# EAGLE design rca_studio_II_mutli_v5 (EAGLE 8.3.2)
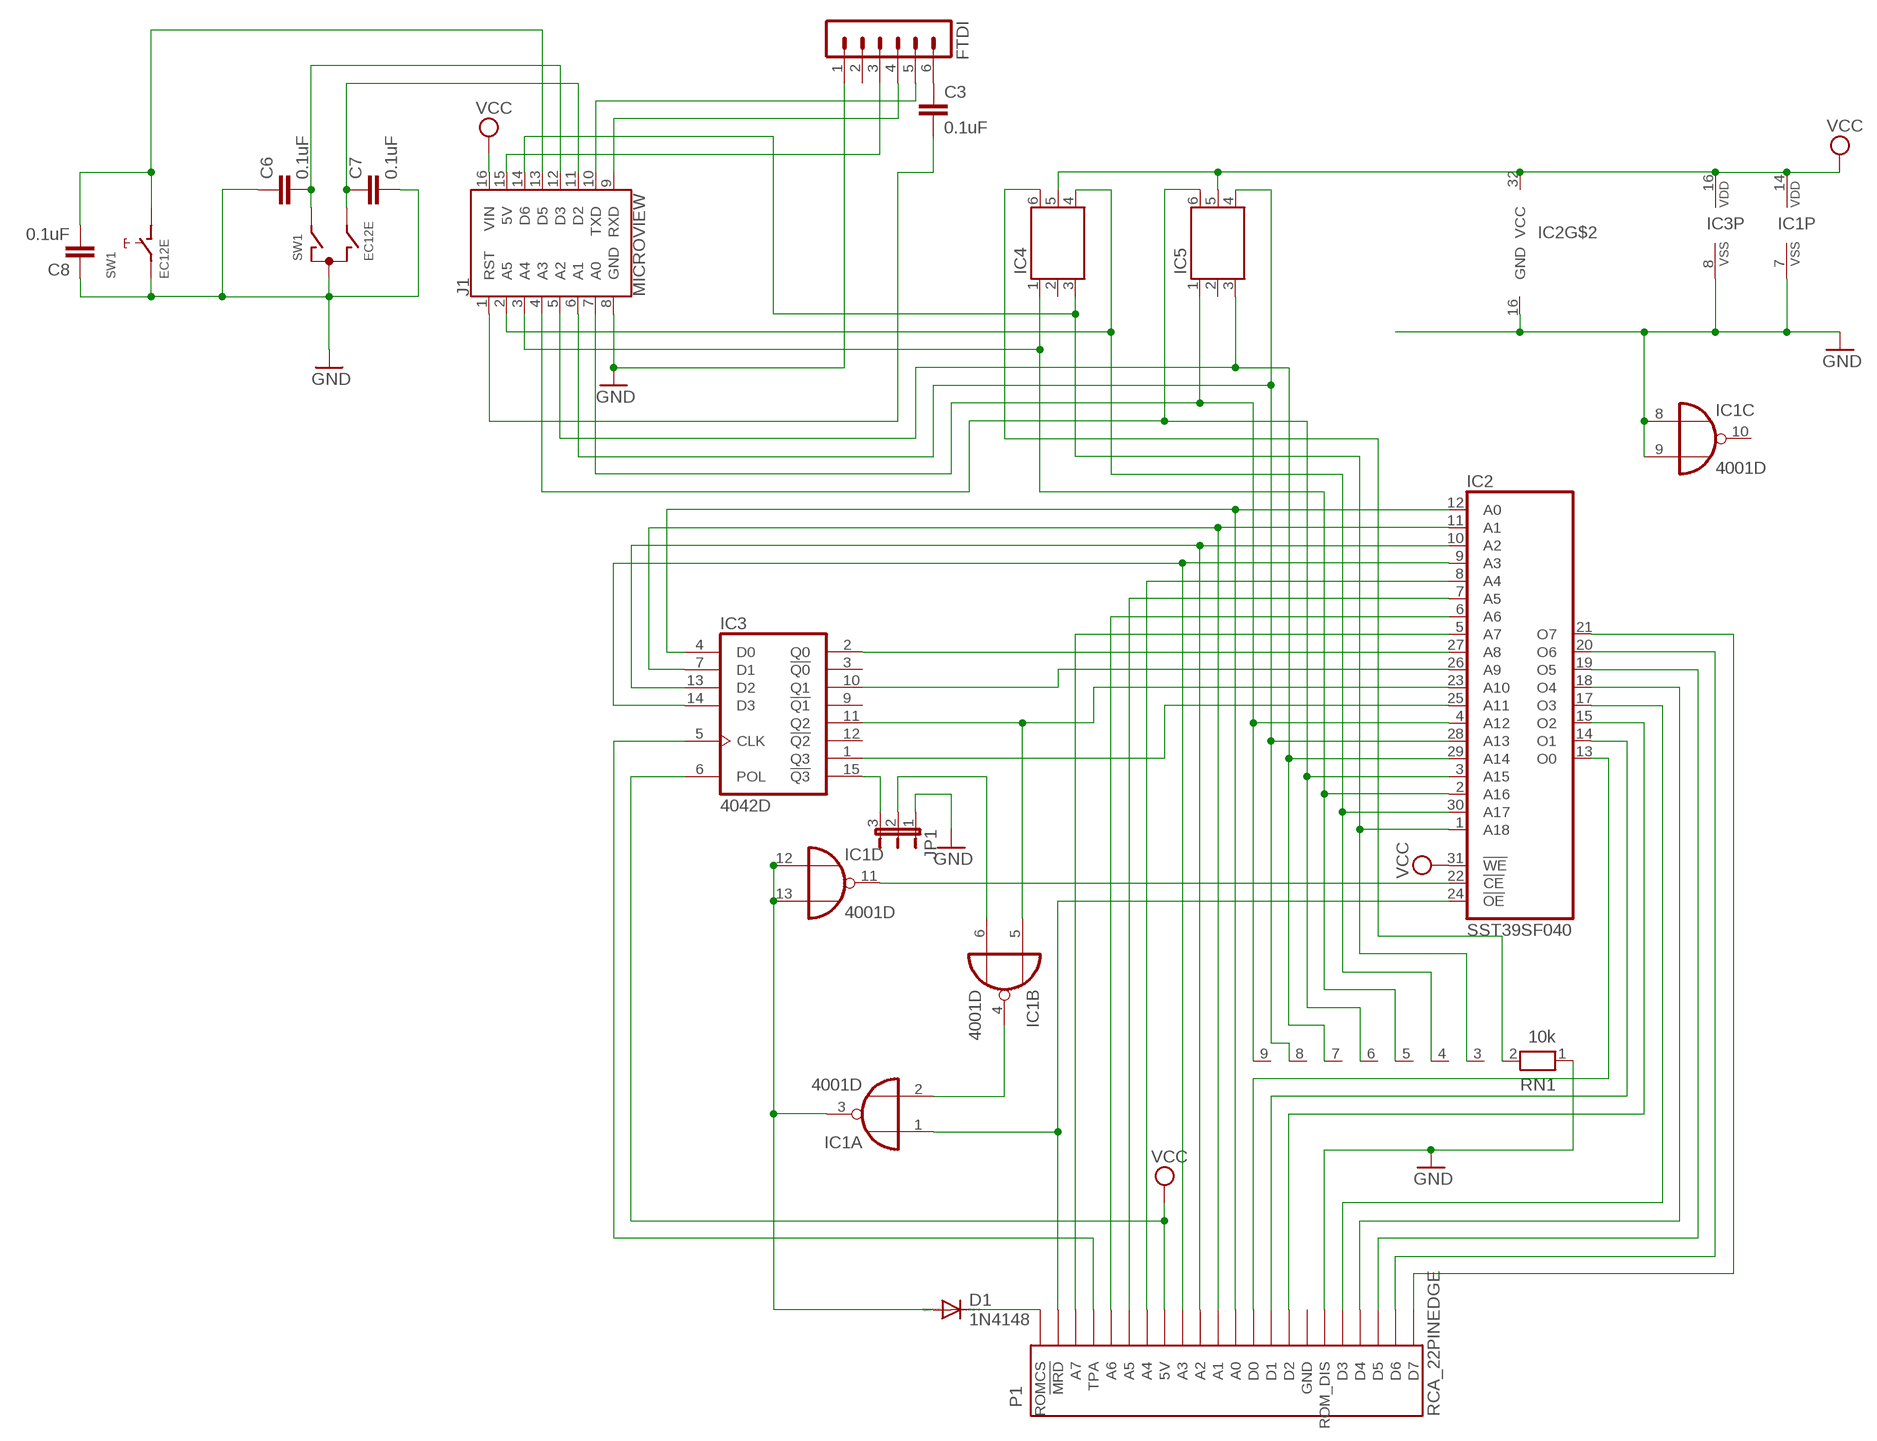
[diagram p0: schematic, sheet 1]

## Parts
C3  0.1uF  C-EUC0805  [C0805]
C6  0.1uF  C-EUC0805  [C0805]
C7  0.1uF  C-EUC0805  [C0805]
C8  0.1uF  C-EUC0805  [C0805]
D1  1N4148  1N4148DO35-7  [DO35-7]
FTDI  MA06-1  [MA06-1]
IC1  4001D  [SO14]
IC2  SST39SF040  [S32]
IC3  4042D  [SO16]
IC4  HEXENCODERHEXENCODER  [HEXENCODER]
IC5  HEXENCODERHEXENCODER  [HEXENCODER]
J1  MICROVIEW  MICROVIEW-16ND  [MV-DIP16-NODIMENSION]
JP1  JP2E  [JP2]
P1  RCA_22PINEDGE  [RCA_22PINEDGE]
RN1  10k  RN08  [RN-9]
SW1  EC12E  EC12E_SW  [ALPS_EC12E_SW]

## Nets
A0: IC2.12(A0) IC3.4(D0) P1.11(A0)
A1: IC2.11(A1) IC3.7(D1) P1.12(A1)
A2: IC2.10(A2) IC3.13(D2) P1.13(A2)
A3: IC2.9(A3) IC3.14(D3) P1.14(A3)
A4: IC2.8(A4) P1.16(A4)
A5: IC2.7(A5) P1.17(A5)
A6: IC2.6(A6) P1.18(A6)
A7: IC2.5(A7) P1.20(A7)
A8: IC2.27(A8) IC3.2(Q0)
A9: IC2.26(A9) IC3.10(Q1)
A10: IC1.5(B:I0) IC2.23(A10) IC3.11(Q2)
A11: IC2.25(A11) IC3.1(Q3)
A12: IC2.4(A12) IC5.1 J1.7(A0) RN1.9
A13: IC2.28(A13) IC5.4 J1.6(A1) RN1.8
A14: IC2.29(A14) IC5.3 J1.5(A2) RN1.7
A15: IC2.3(A15) IC5.6 J1.4(A3) RN1.6
A16: IC2.2(A16) IC4.1 J1.3(A4) RN1.5
A17: IC2.30(A17) IC4.4 J1.2(A5) RN1.4
A18: IC2.1(A18) IC4.3 J1.14(D6) RN1.3
GND: C6.1 C7.2 C8.1 FTDI.1 IC1.7(P:VSS) IC1.8(C:I0) IC1.9(C:I1) IC2.16(GND) IC3.8(VSS) J1.8(GND) JP1.1 P1.6(ROM_DIS) RN1.1 SW1.C SW1.E
N$1: IC1.11(D:O) IC2.22(!CE)
N$2: IC2.21(O7) P1.1(D7)
N$3: IC2.20(O6) P1.2(D6)
N$4: IC2.19(O5) P1.3(D5)
N$5: IC2.18(O4) P1.4(D4)
N$6: IC2.17(O3) P1.5(D3)
N$7: IC2.15(O2) P1.8(D2)
N$8: IC2.14(O1) P1.9(D1)
N$9: IC2.13(O0) P1.10(D0)
N$10: C6.2 J1.12(D3) SW1.A
N$11: IC1.1(A:I0) IC2.24(!OE) P1.21(!MRD)
N$12: C7.1 J1.11(D2) SW1.B
N$13: IC1.2(A:I1) IC1.4(B:O)
N$14: D1.A IC1.3(A:O) IC1.12(D:I0) IC1.13(D:I1)
N$15: C8.2 J1.13(D5) SW1.D
N$16: IC3.15(!Q3) JP1.3
N$17: FTDI.3 J1.15(5V)
N$18: FTDI.4 J1.9(RXD)
N$19: FTDI.5 J1.10(TXD)
N$20: C3.2 J1.1(RST)
N$21: C3.1 FTDI.6
N$22: IC1.6(B:I1) JP1.2
N$28: D1.C P1.22(ROMCS)
N$36: IC4.6 RN1.2
N$45: IC3.5(CLK) P1.19(TPA)
VCC: IC1.14(P:VDD) IC2.31(!WE) IC2.32(VCC) IC3.6(POL) IC3.16(VDD) IC4.5(C2) IC5.5(C2) J1.16(VIN) P1.15(5V)
Unconnected: FTDI.2 IC1.10(C:O) IC3.3(!Q0) IC3.9(!Q1) IC3.12(!Q2) IC4.2(C1) IC5.2(C1) P1.7(GND) SW1.GND1(G) SW1.GND2(G)

## Library data of the parts
C3 C6-C8 = rcl:C-EU: CAPACITOR, European symbol
D1 = diode:1N4148: DIODE high speed (Philips)
FTDI = con-lstb:MA06-1: PIN HEADER; OC_FARNELL: unknown; OC_NEWARK: unknown
IC1 = 40xx:4001: Quad 2-input NOR
IC2 = mylib:SST39SF040: 4 Megabit (512K x8) Multi-Purpose Flash
IC3 = 40xx:4042: Quad clocked D LATCH
IC4 IC5 = mylib:HEXENCODER: Dual In Line / Socket
J1 = microView:MICROVIEW-16
JP1 = jumper:JP2E: JUMPER
P1 = mylib:RCA_22PINEDGE: 22 PIN EDGE CONNECTOR FOR PCB
RN1 = resistor-net:RN08: RESISTOR NETWORK; OC_FARNELL: unknown; OC_NEWARK: unknown
SW1 = switch-alps:EC12E_SW: ALPS rotary Encoder EC12E series with switch; MPN: EC12E2424407; OC_FARNELL: 1520813; OC_NEWARK: 74M1068

## Board
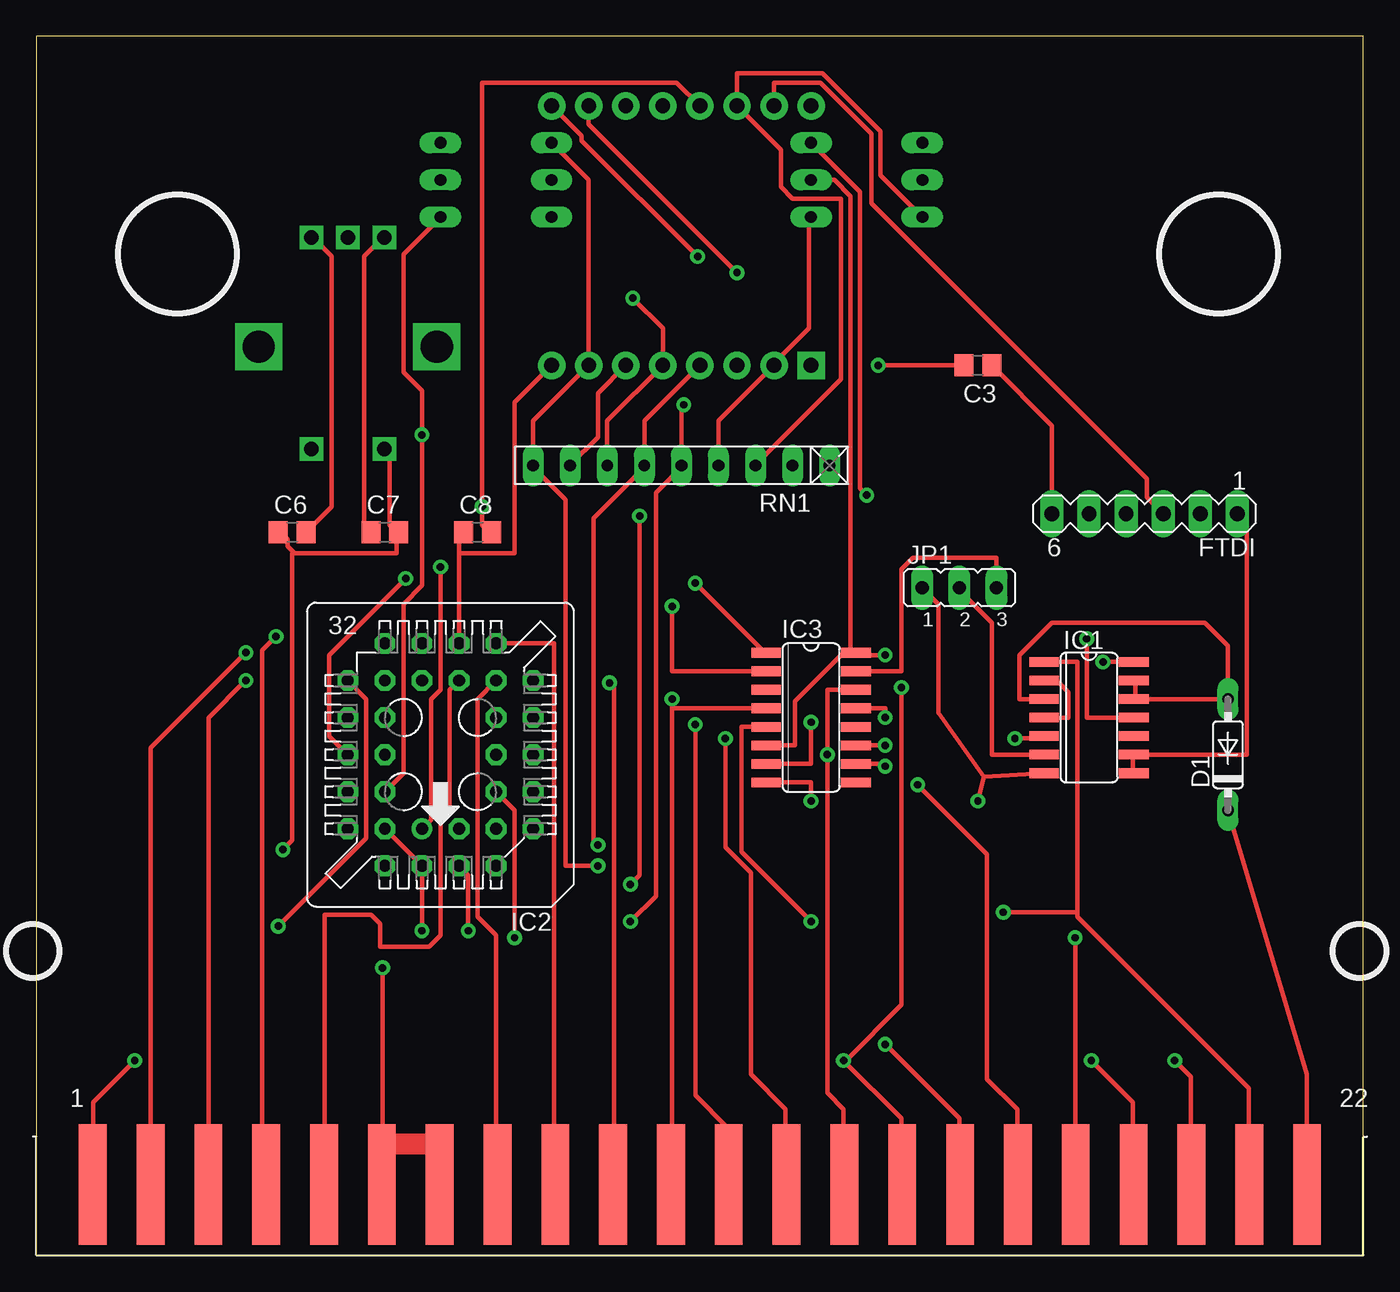
[diagram p1: board, top side]
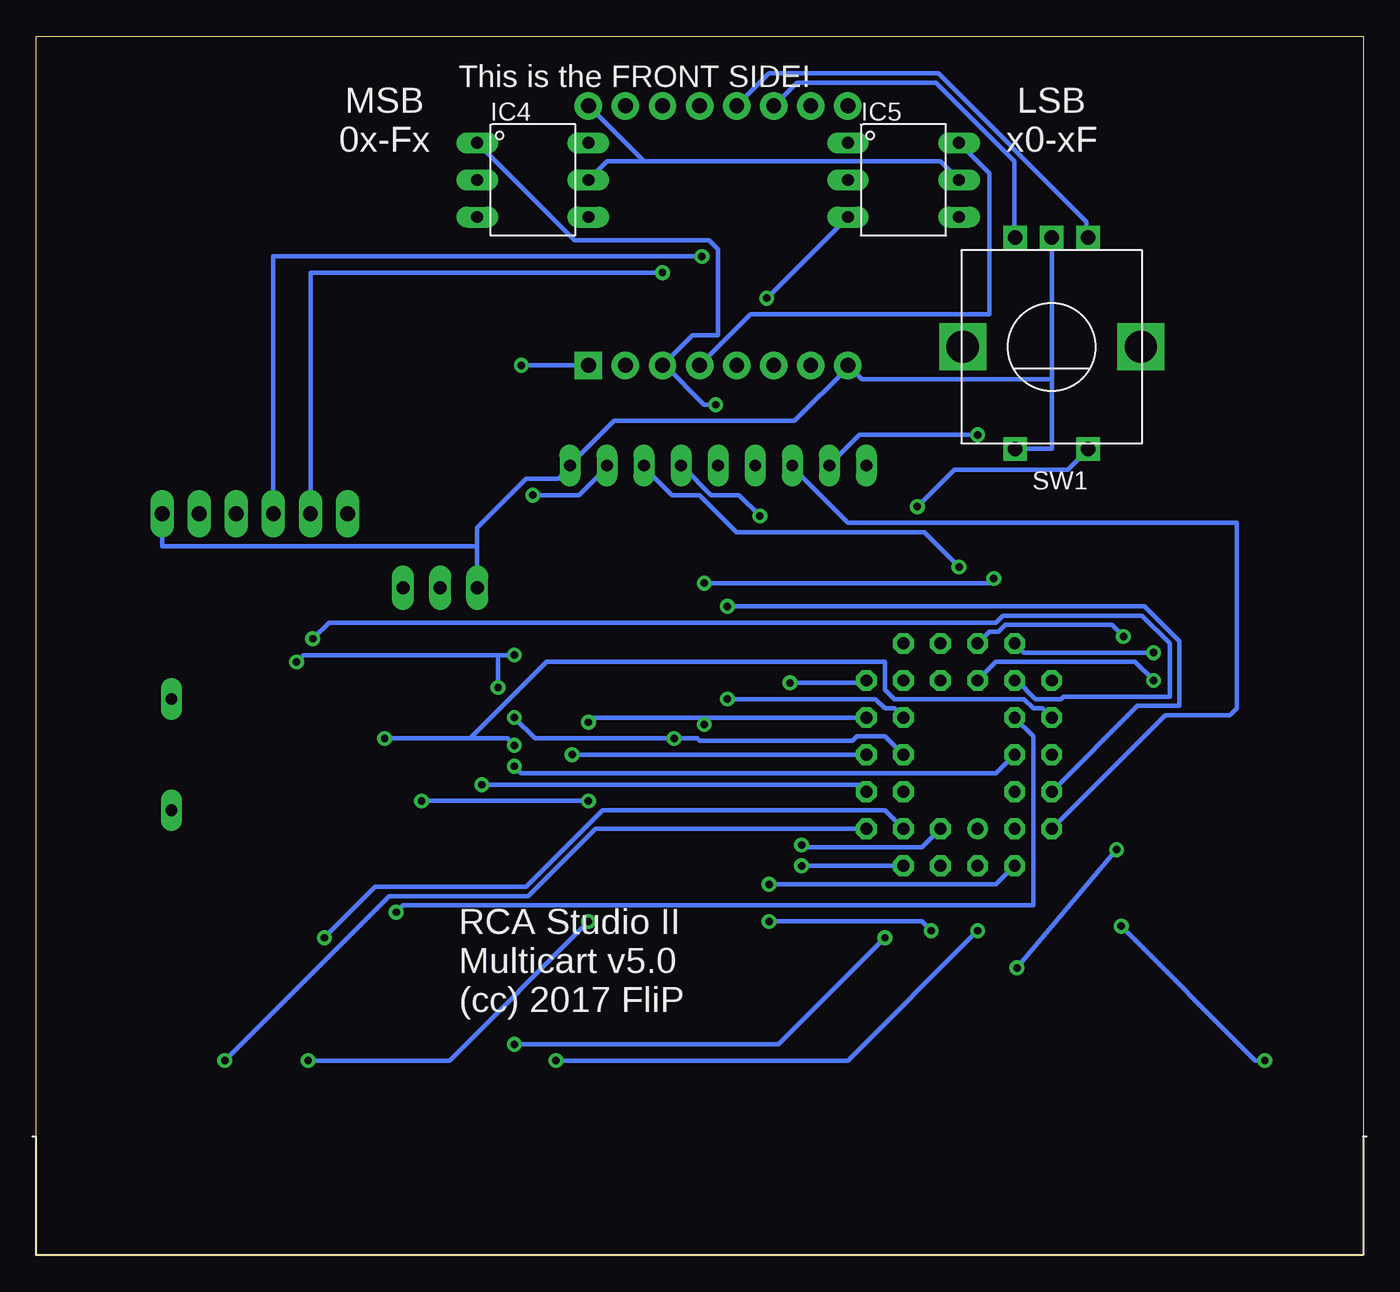
[diagram p2: board, bottom side, seen from below]

Size 90.91 x 83.49 mm. Coordinates in mm from the lower left corner, seen from the top.
Outline: 0,0 90.91,0 90.91,83.49 0,83.49 0,0
Copper layers (1*16): Top 0.035mm / dielectric 1.5mm / Bottom 0.035mm
Design rules "FliP *": minimum track width 12mil, minimum drill 20mil, track to track 10mil, track to pad 15mil, pad to pad 15mil, via to via 15mil, smd to smd 15mil, copper to edge 30mil, drill to drill 15mil, minimum pad ring 12mil, minimum via ring 10mil, stop-mask expansion 4mil, vias tented up to drill 25mil, thermal gap 10mil
tKeepout: area 3.6,63.5 to 15,73.7; area 75.9,63.5 to 86.1,73.7
bKeepout: area 3.6,63.5 to 15,73.7; area 75.9,63.5 to 86.1,73.7
vRestrict: area 17.5,22.9 to 37.8,45.7

### Footprints (pad centres in the part's own frame; a part is rotated, then mirrored left to right if it is on the bottom)
C0805 = smd 1.3 x 1.5: 1 -0.95,0; 2 0.95,0
DO35-7 = drill 0.813 long: A 3.81,0; C -3.81,0
MA06-1 = drill 1.016 long: 1 -6.35,0; 2 -3.81,0; 3 -1.27,0; 4 1.27,0; 5 3.81,0; 6 6.35,0
SO14 = smd 0.66 x 2.032: 1 -3.81,-3.073; 2 -2.54,-3.073; 3 -1.27,-3.073; 4 0,-3.073; 5 1.27,-3.073; 6 2.54,-3.073; 7 3.81,-3.073; 8 3.81,3.073; 9 2.54,3.073; 10 1.27,3.073; 11 0,3.073; 12 -1.27,3.073; 13 -2.54,3.073; 14 -3.81,3.073
S32 = drill 0.813: 1 1.27,5.08 | drill 0.813 octagon: 2 -1.27,7.62; 3 -1.27,5.08; 4 -3.81,7.62; 5 -6.35,5.08; 6 -3.81,5.08; 7 -6.35,2.54; 8 -3.81,2.54; 9 -6.35,0; 10 -3.81,0; 11 -6.35,-2.54; 12 -3.81,-2.54; 13 -6.35,-5.08; 14 -3.81,-7.62; 15 -3.81,-5.08; 16 -1.27,-7.62; 17 -1.27,-5.08; 18 1.27,-7.62; 19 1.27,-5.08; 20 3.81,-7.62; 21 6.35,-5.08; 22 3.81,-5.08; 23 6.35,-2.54; 24 3.81,-2.54; 25 6.35,0; 26 3.81,0; 27 6.35,2.54; 28 3.81,2.54; 29 6.35,5.08; 30 3.81,7.62; 31 3.81,5.08; 32 1.27,7.62
SO16 = smd 0.66 x 2.032: 1 -4.445,-3.073; 2 -3.175,-3.073; 3 -1.905,-3.073; 4 -0.635,-3.073; 5 0.635,-3.073; 6 1.905,-3.073; 7 3.175,-3.073; 8 4.445,-3.073; 9 4.445,3.073; 10 3.175,3.073; 11 1.905,3.073; 12 0.635,3.073; 13 -0.635,3.073; 14 -1.905,3.073; 15 -3.175,3.073; 16 -4.445,3.073
HEXENCODER = drill 0.813 long: 1 -2.54,-3.81; 2 0,-3.81; 3 2.54,-3.81; 4 2.54,3.81; 5 0,3.81; 6 -2.54,3.81
MV-DIP16-NODIMENSION = drill 1.016 pad 1.88 square: 1 0,0 | drill 1.016 pad 1.88: 2 2.54,0; 3 5.08,0; 4 7.62,0; 5 10.16,0; 6 12.7,0; 7 15.24,0; 8 17.78,0; 9 17.78,17.78; 10 15.24,17.78; 11 12.7,17.78; 12 10.16,17.78; 13 7.62,17.78; 14 5.08,17.78; 15 2.54,17.78; 16 0,17.78
JP2 = drill 0.914 long: 1 -2.54,0; 2 0,0; 3 2.54,0
RCA_22PINEDGE = smd 1.905 x 8.255: 1 -41.605,4.826; 2 -37.643,4.826; 3 -33.68,4.826; 4 -29.718,4.826; 5 -25.756,4.826; 6 -21.793,4.826; 7 -17.831,4.826; 8 -13.868,4.826; 9 -9.906,4.826; 10 -5.944,4.826; 11 -1.981,4.826; 12 1.981,4.826; 13 5.944,4.826; 14 9.906,4.826; 15 13.868,4.826; 16 17.831,4.826; 17 21.793,4.826; 18 25.756,4.826; 19 29.718,4.826; 20 33.68,4.826; 21 37.643,4.826; 22 41.605,4.826
RN-9 = drill 0.813 long: 1 -10.16,0; 2 -7.62,0; 3 -5.08,0; 4 -2.54,0; 5 0,0; 6 2.54,0; 7 5.08,0; 8 7.62,0; 9 10.16,0
ALPS_EC12E_SW = drill 1 square: A -2.5,-7.5; B 2.5,-7.5; C 0,-7.5; D -2.5,7; E 2.5,7 | drill 2.2 square: GND1 -6.1,0; GND2 6.1,0

### Placement (x,y rotation side)
C3  64.52,60.96 180 top
C6  17.53,49.53 0 top
C7  23.88,49.53 0 top
C8  30.23,49.53 0 top
D1  81.66,34.29 90 top
FTDI  75.95,50.8 180 top
IC1  72.14,36.83 270 top
IC2  27.69,34.29 180 top
IC3  53.09,36.83 270 top
IC4  56.9,73.66 270 bottom
IC5  31.5,73.66 270 bottom
J1  53.09,60.96 0 bottom
JP1  63.25,45.72 0 top
P1  45.47,0 0 top
RN1  44.2,54.1 180 top
SW1  21.34,62.23 180 bottom

### Tracks (layer width: path | path; a pad name or v marks a point on that pad's centre or on a via)
A0  (via drill 0.51)
  Top 0.305: 43.56,37.47 IC3.4 | 43.56,37.47 43.56,4.92 P1.11 | 43.56,37.47 v43.56,38.1
  Bottom 0.305: IC2.12 32.13,37.47 32.77,37.47 33.4,38.1 v43.56,38.1
A1  (via drill 0.51)
  Top 0.305: IC3.7 53.09,33.66 v53.09,36.51 | v45.15,36.35 45.15,10.95 47.37,8.73 P1.12
  Bottom 0.305: v53.09,36.51 52.77,36.83 45.15,36.83 | IC2.11 45.15,36.83 | 45.15,36.83 v45.15,36.35
A2  (via drill 0.51)
  Top 0.305: IC3.13 58.17,37.47 v58.17,36.83 | v47.21,35.4 47.21,27.94 48.96,26.19 48.96,12.38 51.34,10 P1.13
  Bottom 0.305: v58.17,36.83 56.74,35.4 v47.21,35.4 45.62,35.4 45.47,35.24 34.99,35.24 34.67,35.56 32.77,35.56 IC2.10
A3  (via drill 0.51)
  Top 0.305: IC3.14 54.2,38.73 v54.2,34.29 54.2,11.11 55.31,10 P1.14
  Bottom 0.305: v54.2,34.29 IC2.9
A4  (via drill 0.51)
  Top 0.305: IC2.8 32.77,30.48 v32.77,21.75 | v58.17,14.45 63.25,9.37 63.25,4.92 P1.16
  Bottom 0.305: v32.77,21.75 40.07,14.45 v58.17,14.45
A5  (via drill 0.51)
  Top 0.305: v60.39,32.23 65.15,27.46 65.15,12.06 67.21,10 P1.17
  Bottom 0.305: IC2.7 34.51,32.23 v60.39,32.23
A6  (via drill 0.51)
  Top 0.305: v71.18,21.75 71.18,4.92 P1.18
  Bottom 0.305: IC2.6 32.77,30.48 52.13,30.48 57.37,25.24 67.69,25.24 v71.18,21.75
A7  (via drill 0.51)
  Top 0.305: v78.01,13.34 79.12,12.22 79.12,4.92 P1.20
  Bottom 0.305: IC2.5 52.61,29.21 57.21,24.61 66.74,24.61 v78.01,13.34
A8  (via drill 0.51)
  Top 0.305: IC3.2 43.56,40.01 v43.56,44.45
  Bottom 0.305: v43.56,44.45 14.99,44.45 12.61,42.07 12.61,37.62 15.46,37.62 IC2.27
A9  (via drill 0.51)
  Top 0.305: IC3.10 58.17,33.66 v58.17,33.5
  Bottom 0.305: v58.17,33.5 57.69,33.02 25.15,33.02 IC2.26
A10  (via drill 0.51)
  Top 0.305: v58.17,34.92 IC3.11 | v67.06,35.4 68.96,35.4 68.96,35.56 IC1.5
  Bottom 0.305: v58.17,34.92 58.64,35.4 61.18,35.4 | v67.06,35.4 61.18,35.4 | IC2.23 21.97,37.47 22.61,37.47 23.24,38.1 32.13,38.1 32.77,38.73 32.77,40.64 55.94,40.64 61.18,35.4
A11  (via drill 0.51)
  Top 0.305: v45.15,46.04 49.91,41.27 IC3.1 | v25.3,46.35 20.07,41.12 20.07,35.56 IC2.25
  Bottom 0.305: v45.15,46.04 25.62,46.04 v25.3,46.35
A12  (via drill 0.51)
  Top 0.305: IC5.1 37.85,73.66 J1.7 34.04,57.15 RN1.9 34.04,53.98 36.26,51.75 36.26,26.67 v38.48,26.67
  Bottom 0.305: v38.48,26.67 IC2.4
A13  (via drill 0.51)
  Top 0.305: J1.6 38.48,59.05 38.48,56.04 36.58,54.13 RN1.8 | IC2.28 25.15,33.02 25.15,44.61 26.42,45.88 v26.42,56.2 26.42,59.21 25.15,60.48 25.15,68.58 IC5.4
  Bottom 0.305: v26.42,56.2 34.51,56.2 36.58,54.13 RN1.8
A14  (via drill 0.51)
  Top 0.305: v40.86,65.56 42.93,63.5 J1.5 39.12,57.15 RN1.7
  Bottom 0.305: v40.86,65.56 IC5.3 | IC2.29 13.56,36.99 9.11,36.99 8.64,37.47 8.64,50.16 35.31,50.16 39.12,53.98 RN1.7
A15  (via drill 0.51)
  Top 0.305: v38.48,28.1 38.16,28.42 38.16,50.48 41.66,53.98 RN1.6 41.66,57.15 J1.4
  Bottom 0.305: IC5.6 25.62,74.14 25.62,64.45 41.97,64.45 J1.4 | IC2.3 30.23,27.94 38.32,27.94 v38.48,28.1
A16  (via drill 0.51)
  Top 0.305: IC2.2 29.59,26.04 v29.59,22.23 | v40.7,22.86 42.45,24.61 42.45,52.23 44.2,53.98 RN1.5 44.2,58.1 v44.36,58.26
  Bottom 0.305: IC4.1 54.04,69.53 44.83,69.53 44.2,68.9 44.2,63.02 45.94,63.02 J1.3 47.85,60.96 45.15,58.26 v44.36,58.26 | v29.59,22.23 30.23,22.86 v40.7,22.86
A17  (via drill 0.51)
  Top 0.305: IC4.4 52.93,70.96 52.93,63.5 50.55,61.12 J1.2 46.74,57.15 RN1.4 | v40.7,25.4 41.34,26.04 v41.34,50.64
  Bottom 0.305: IC2.30 25.15,25.4 v40.7,25.4 | v41.34,50.64 42.77,52.07 44.67,52.07 46.58,53.98 46.74,53.98 RN1.4
A18  (via drill 0.51)
  Top 0.305: IC4.3 57.85,73.98 57.85,76.99 53.88,80.96 48.01,80.96 J1.14 51.02,75.72 51.02,73.18 51.82,72.39 55.15,72.39 55.15,60.01 49.28,54.13 RN1.3 | IC2.1 27.05,29.84 27.05,38.1 27.69,38.73 v27.69,47.15
  Bottom 0.305: v27.69,47.15 30.07,49.53 42.93,49.53 45.47,52.07 47.37,52.07 49.28,53.98 RN1.3
GND  (via drill 0.51)
  Top 0.305: IC1.8 75.15,33.02 75.15,34.29 IC1.9 82.93,34.29 82.93,50.16 FTDI.1 | IC3.8 53.09,32.38 v53.09,31.11 | 64.91,32.78 68.96,33.02 IC1.7 | 64.91,32.78 v64.52,31.11 | JP1.1 61.82,44.61 61.82,37.15 64.91,32.78 | IC2.16 28.96,48.1 | 28.96,48.1 28.96,49.21 C8.1 | 17.61,48.18 17.68,48.1 24.67,48.1 24.67,49.53 | 17.61,48.18 17.21,48.58 17.21,49.05 16.73,49.53 C6.1 | 24.67,49.53 24.19,50.01 24.19,54.77 23.88,55.09 SW1.E | 24.67,49.53 C7.2 | 28.96,48.1 32.77,48.1 32.77,58.42 J1.8 | v23.72,19.68 23.72,7.3 23.56,6.19 P1.6 | v16.89,27.78 17.53,28.42 17.53,48.1 17.61,48.18
  Bottom 0.305: JP1.1 60.71,48.58 | 60.71,48.58 60.71,49.85 57.37,53.18 55.15,53.18 54.36,53.98 RN1.1 54.36,54.13 51.34,57.15 38.96,57.15 35.31,60.8 J1.8 34.35,60.01 21.34,60.01 | v64.52,31.11 v53.09,31.11 | FTDI.1 82.3,48.58 60.71,48.58 | 21.34,60.01 21.34,55.24 23.72,55.24 SW1.E | 21.34,60.01 SW1.C | v16.89,27.78 v23.72,19.68
N$1  (via drill 0.51)
  Top 0.305: IC1.11 71.98,36.83 v71.98,42.23
  Bottom 0.305: v71.98,42.23 70.87,43.34 25.15,43.34 24.67,43.81 15.14,43.81 13.24,41.91 13.24,38.26 20.54,38.26 20.7,38.1 22.45,38.1 23.72,39.37 IC2.22
N$2  (via drill 0.51)
  Top 0.305: IC2.21 22.61,38.1 22.61,28.57 v16.57,22.54 | v6.73,13.34 3.87,10.48 3.87,4.92 P1.1
  Bottom 0.305: v16.57,22.54 7.37,13.34 v6.73,13.34
N$3  (via drill 0.51)
  Top 0.305: v14.35,41.27 7.84,34.77 7.84,4.92 P1.2
  Bottom 0.305: IC2.20 23.24,41.27 v14.35,41.27
N$4  (via drill 0.51)
  Top 0.305: v14.35,39.37 11.81,36.83 11.81,4.92 P1.3
  Bottom 0.305: IC2.19 25.15,40.64 15.62,40.64 v14.35,39.37
N$5  (via drill 0.51)
  Top 0.305: v16.41,42.39 15.46,41.43 15.46,5.08 15.62,4.92 P1.4
  Bottom 0.305: IC2.18 25.62,42.7 24.99,42.7 24.51,43.18 17.21,43.18 v16.41,42.39
N$6
  Top 0.305: IC2.17 28.32,38.73 28.32,30.48 27.69,29.84 27.69,21.91 26.89,21.11 23.56,21.11 23.56,22.7 22.92,23.34 19.75,23.34 19.75,4.92 P1.5
N$7
  Top 0.305: IC2.15 30.23,38.1 30.23,23.18 31.5,21.91 31.5,4.92 P1.8
N$8
  Top 0.305: IC2.14 35.47,41.91 35.47,4.92 P1.9
N$9  (via drill 0.51)
  Top 0.305: v39.28,39.21 39.59,38.89 39.59,4.92 P1.10
  Bottom 0.305: IC2.13 34.2,39.21 v39.28,39.21
N$10
  Top 0.305: C6.2 20.22,51.28 20.22,68.42 18.95,69.69 SW1.A
  Bottom 0.305: J1.12 40.7,80.96 29.11,80.96 18.95,70.8 18.95,69.85 SW1.A
N$11  (via drill 0.51)
  Top 0.305: IC1.1 71.34,40.64 71.34,23.5 | 71.34,23.5 71.34,23.18 83.09,11.43 83.09,4.92 P1.21 | 71.34,23.5 v66.26,23.5
  Bottom 0.305: IC2.24 22.61,35.56 22.61,23.97 65.79,23.97 v66.26,23.5
N$12
  Top 0.305: C7.1 22.45,50.01 22.45,68.42 23.72,69.69 SW1.B
  Bottom 0.305: J1.11 38.8,80.33 29.27,80.33 23.88,74.93 23.88,69.85 SW1.B
N$13
  Top 0.305: IC1.4 70.71,36.83 70.71,38.58 69.91,39.37 IC1.2
N$14
  Top 0.305: IC1.3 67.37,38.1 67.37,41.12 69.6,43.34 80.07,43.34 81.66,41.75 D1.A 75.31,38.1 | 75.31,39.37 IC1.13 75.31,39.27 75.31,38.1 | IC1.12 75.31,38.1
N$15  (via drill 0.51)
  Top 0.305: C8.2 31.02,49.53 30.54,50.01 v30.54,51.28 30.54,80.33 43.88,80.33 J1.13
  Bottom 0.305: v30.54,51.28 28,53.82 20.22,53.82 18.95,55.09 SW1.D
N$16
  Top 0.305: IC3.15 59.28,40.01 59.28,46.99 60.07,47.78 65.79,47.78 JP1.3
N$17
  Top 0.305: FTDI.3 76.1,51.91 76.1,53.18 57.21,72.07 57.21,76.83 53.72,80.33 50.55,80.33 J1.15
N$18  (via drill 0.51)
  Top 0.305: v45.31,68.42 37.37,76.36 37.37,76.68 J1.9
  Bottom 0.305: FTDI.4 74.68,68.42 v45.31,68.42
N$19  (via drill 0.51)
  Top 0.305: v48.01,67.31 37.85,77.47 J1.10
  Bottom 0.305: FTDI.5 72.14,67.31 v48.01,67.31
N$20  (via drill 0.51)
  Top 0.305: v57.69,60.96 C3.2
  Bottom 0.305: J1.1 v57.69,60.96
N$21
  Top 0.305: FTDI.6 69.6,56.83 C3.1
N$22
  Top 0.305: IC1.6 65.47,34.29 65.47,43.34 63.25,45.56 JP1.2
N$28
  Top 0.305: D1.C 87.06,12.38 87.06,4.92 P1.22
N$36  (via drill 0.51)
  Top 0.305: v56.9,52.07 56.42,52.55 56.42,72.87 IC4.6
  Bottom 0.305: v56.9,52.07 53.72,52.07 51.82,53.98 RN1.2
N$37
  Top 1.422: 23.88,7.62 27.69,7.62
N$45  (via drill 0.51)
  Top 0.305: IC3.5 48.32,36.2 48.32,27.62 v53.09,22.86 | v72.3,13.34 75.15,10.48 75.15,4.92 P1.19
  Bottom 0.305: v53.09,22.86 62.61,13.34 v72.3,13.34
VCC  (via drill 0.51)
  Top 0.305: IC2.31 IC2.32 v26.42,22.23 | P1.15 59.28,4.92 59.28,9.37 v55.31,13.34 55.47,13.34 59.28,17.14 v59.28,38.89 | IC3.6 51.98,34.92 51.98,37.94 55.31,41.27 55.79,41.27 | IC3.16 55.79,41.27 | v73.09,40.64 IC1.14 | v58.17,41.12 56.26,41.12 56.26,41.27 IC3.16 | 55.79,41.27 55.79,72.55 54.67,73.66 IC4.5 | 56.1,41.27 IC3.16
  Bottom 0.305: v26.42,22.23 35.31,13.34 v55.31,13.34 | v73.09,40.64 72.61,41.12 59.28,41.12 | v58.17,41.12 59.28,41.12 | IC5.5 28.96,74.93 49.28,74.93 | 49.28,74.93 51.82,74.93 IC4.5 | 49.28,74.93 J1.16 | 59.28,41.12 v59.28,38.89

### Text on the board
bNames: LSB / x0-xF | This is the FRONT SIDE! | MSB / 0x-Fx | RCA Studio II / Multicart v5.0 / (cc) 2017 FliP